# Altium schematic sheet LNA.SchDoc
size A4
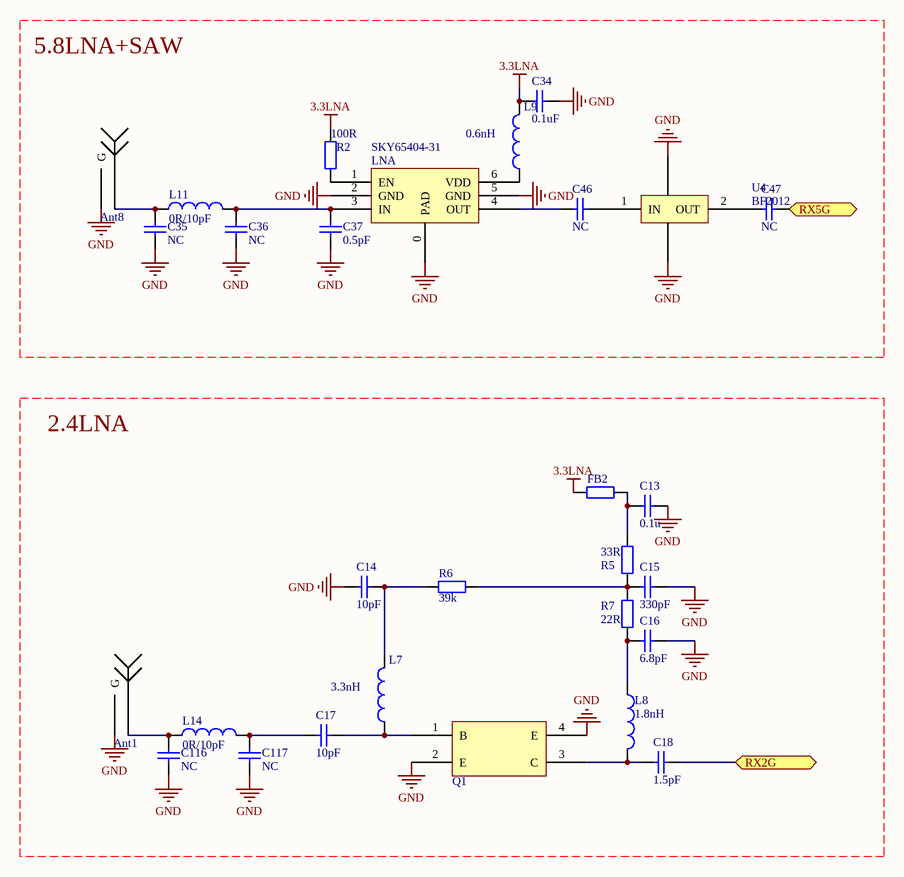
[diagram p0: LNA.SchDoc]

## Parts
Ant1  Antenna  [SMA-2]  (value not drawn)
Ant8  Antenna  [SMA-2]  (value not drawn)
C13  value 0.1u  [0402]  (hidden comment: Cap)
C14  value 10pF  [0402]  (hidden comment: Cap)
C15  value 330pF  [0402]  (hidden comment: Cap)
C16  value 6.8pF  [0402]  (hidden comment: Cap)
C17  value 10pF  [0402]  (hidden comment: Cap)
C18  value 1.5pF  [0402]  (hidden comment: Cap)
C34  value 0.1uF  [0402]  (hidden comment: Cap)
C35  value NC  [0402]  (hidden comment: Cap)
C36  value NC  [0402]  (hidden comment: Cap)
C37  value 0.5pF  [0402]  (hidden comment: Cap)
C46  value NC  [0402]  (hidden comment: Cap)
C47  value NC  [0402]  (hidden comment: Cap)
C116  value NC  [0402]  (hidden comment: Cap)
C117  value NC  [0402]  (hidden comment: Cap)
FB2  Res2  [0402]  (value not drawn)
L7  value 3.3nH  [0402]  (hidden comment: Inductor)
L8  value 1.8nH  [0402]  (hidden comment: Inductor)
L9  value 0.6nH  [0402]  (hidden comment: Inductor)
L11  value 0R/10pF  [0402]  (hidden comment: Inductor)
L14  value 0R/10pF  [0402]  (hidden comment: Inductor)
LNA  SKY65404-31  [SKY65404-31]
Q1  RF_BJT  [SOT343-4(RF)]  (value not drawn)
R2  value 100R  [0402]  (hidden comment: Res2)
R5  value 33R  [0402]  (hidden comment: Res2)
R6  value 39k  [0402]  (hidden comment: Res2)
R7  value 22R  [0402]  (hidden comment: Res2)
U4  BF2012  [LFB2H5]

## Ports
RX2G, RX5G

## Nets
3.3LNA: C34.2 FB2.1 L9.2 R2.2
GND: Ant1.GND(G) Ant8.GND(G) C13.1 C14.2 C15.2 C16.1 C34.1 C35.1 C36.1 C37.1 C116.1 C117.1 LNA.0(PAD) LNA.2(GND) LNA.5(GND) Q1.2(E) Q1.4(E) U4.0(GND)
RX2G: C18.1 ; port RX2G
RX5G: C47.2 ; port RX5G
NetAnt1_1: Ant1.1 C116.2 L14.1
NetAnt8_1: Ant8.1 C35.2 L11.1
NetC13_2: C13.2 FB2.2 R5.2
NetC14_1: C14.1 L7.2 R6.2
NetC15_1: C15.1 R5.1 R6.1 R7.1
NetC16_2: C16.2 L8.1 R7.2
NetC17_1: C17.1 L7.1 Q1.1(B)
NetC17_2: C17.2 C117.2 L14.2
NetC18_2: C18.2 L8.2 Q1.3(C)
NetC36_2: C36.2 C37.2 L11.2 LNA.3(IN)
NetC46_1: C46.1 LNA.4(OUT)
NetC46_2: C46.2 U4.1(IN)
NetC47_1: C47.1 U4.2(OUT)
NetL9_1: L9.1 LNA.6(VDD)
NetLNA_1: LNA.1(EN) R2.1

## Notes on the sheet
- 5.8LNA+SAW
- 2.4LNA

## Library data of the parts
C13-C18 C34-C37 C46 C47 C116 C117 = Cap: Capacitor; Published: 8-Jun-2000; LatestRevisionDate: 17-Jul-2002; LatestRevisionNote: Re-released for DXP Platform.; PackageReference: RAD-0.3; Publisher: Altium Limited; PackageDescription: Radial Cap, Thru-Hole; 2 Leads; 0.3 in Pin Spacing
FB2 = Res2: Resistor; Value: FB; Published: 8-Jun-2000; LatestRevisionDate: 17-Jul-2002; LatestRevisionNote: Re-released for DXP Platform.; PackageReference: AXIAL-0.4; Publisher: Altium Limited; PackageDescription: Axial Device, Thru-Hole; 2 Leads; 0.4 in Pin Spacing
L7-L9 L11 L14 = Inductor: Code_IEC: 1005; Published: 8-Jun-2000; LatestRevisionDate: 29-May-2009; LatestRevisionNote: IPC-7351 Footprint Added.; PackageReference: 0402-A; Publisher: Altium Limited; PackageDescription: Chip Inductor; Code_JEITA: 0402
R2 R5-R7 = Res2: Resistor; Published: 8-Jun-2000; LatestRevisionDate: 17-Jul-2002; LatestRevisionNote: Re-released for DXP Platform.; PackageReference: AXIAL-0.4; Publisher: Altium Limited; PackageDescription: Axial Device, Thru-Hole; 2 Leads; 0.4 in Pin Spacing